# Altium schematic sheet Quectel_BG77_SCH_Part_AD_V1.1.SchDoc
size 840 x 594 mm
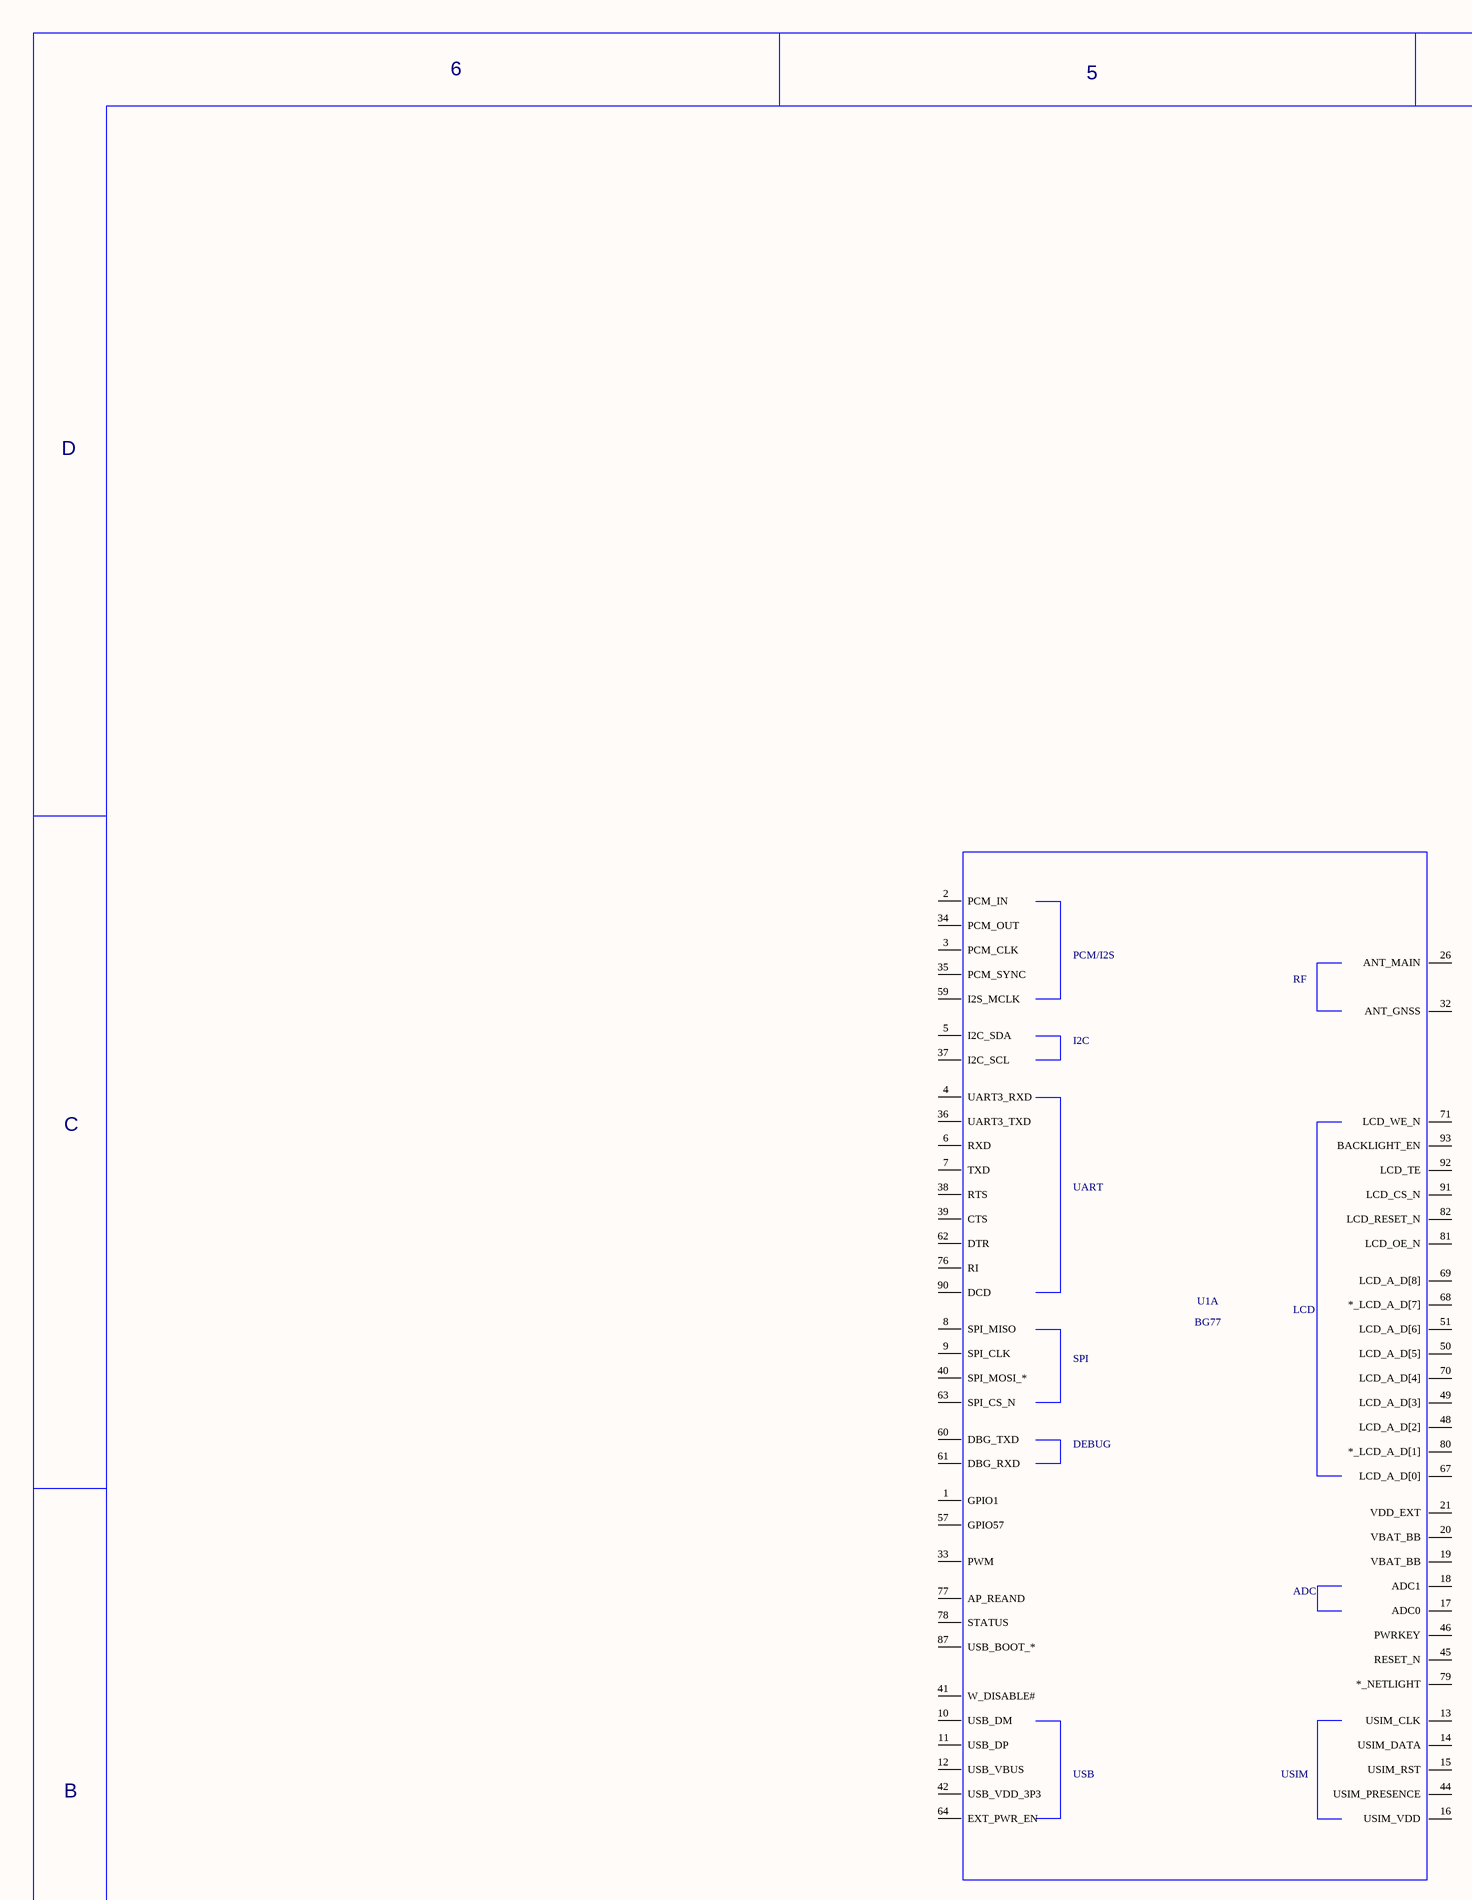
[diagram p0: Quectel_BG77_SCH_Part_AD_V1.1.SchDoc, top left]
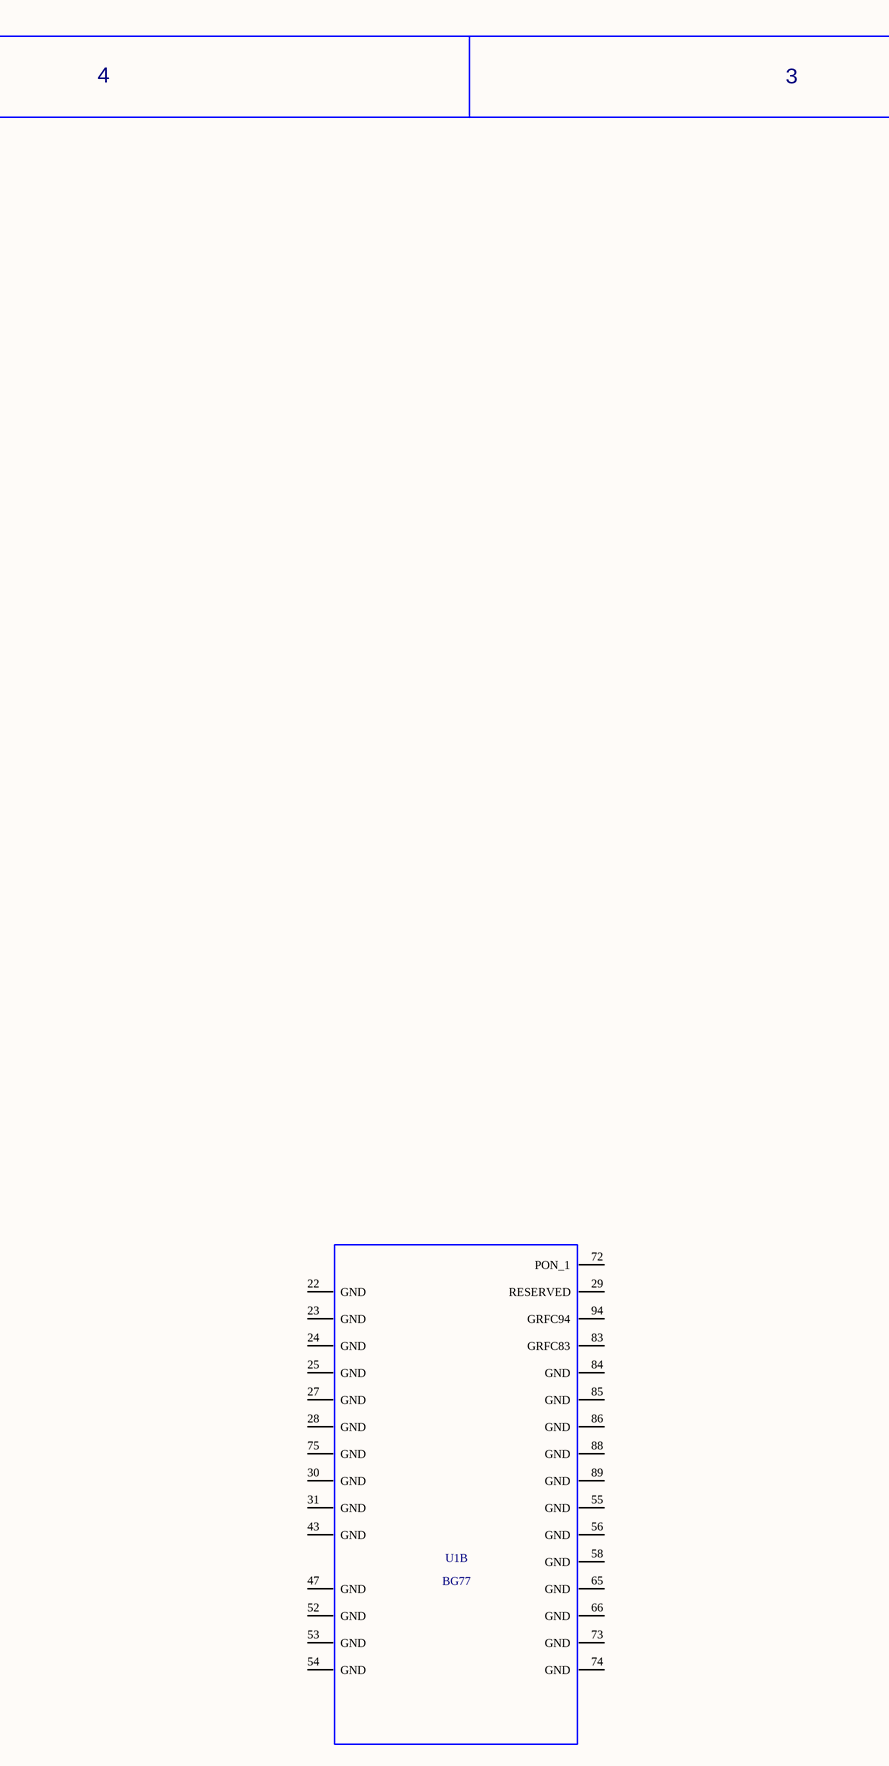
[diagram p1: Quectel_BG77_SCH_Part_AD_V1.1.SchDoc, top middle]
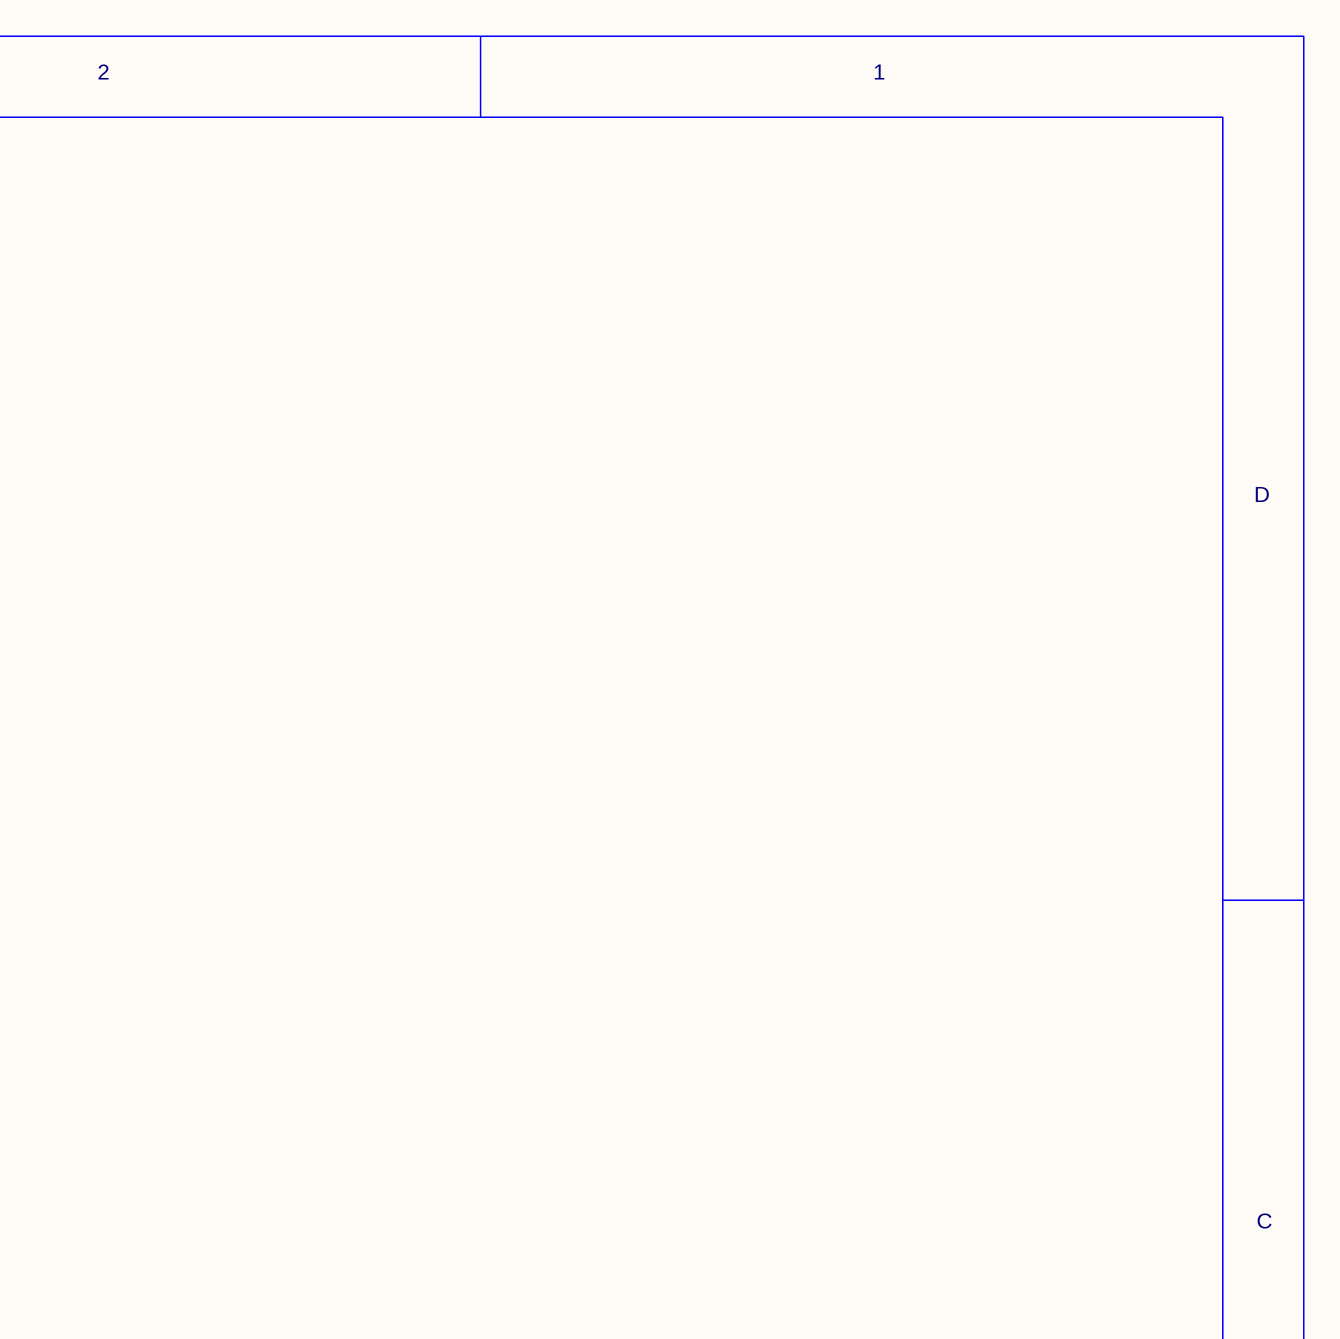
[diagram p2: Quectel_BG77_SCH_Part_AD_V1.1.SchDoc, top right]
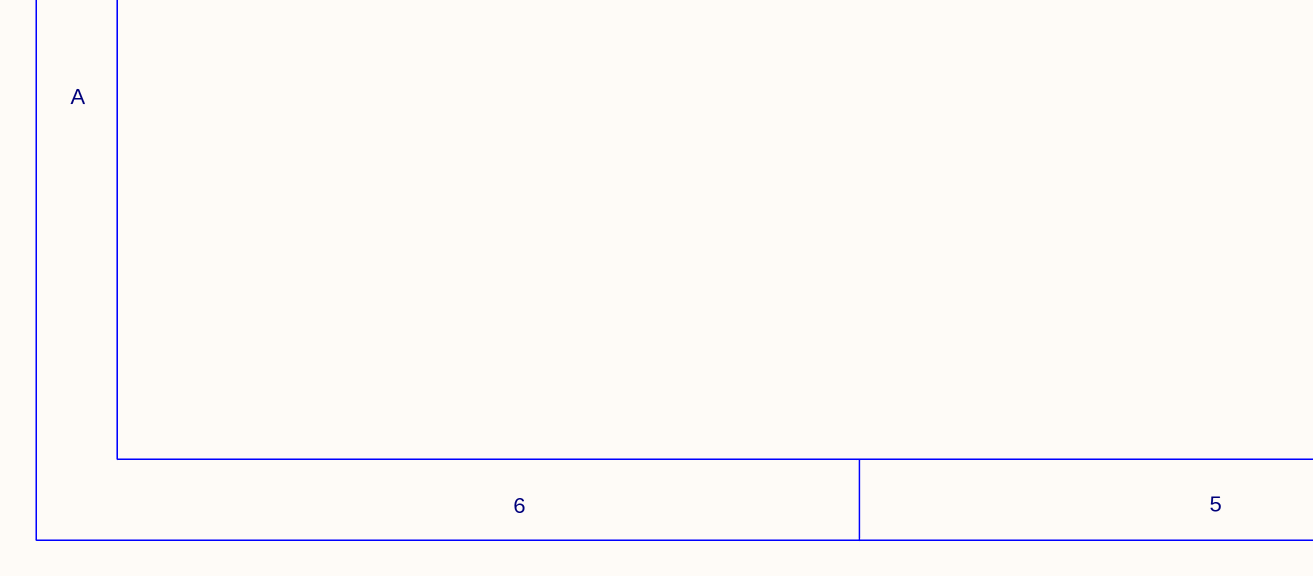
[diagram p3: Quectel_BG77_SCH_Part_AD_V1.1.SchDoc, bottom left]
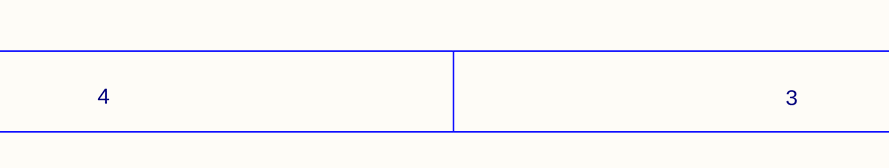
[diagram p4: Quectel_BG77_SCH_Part_AD_V1.1.SchDoc, bottom middle]
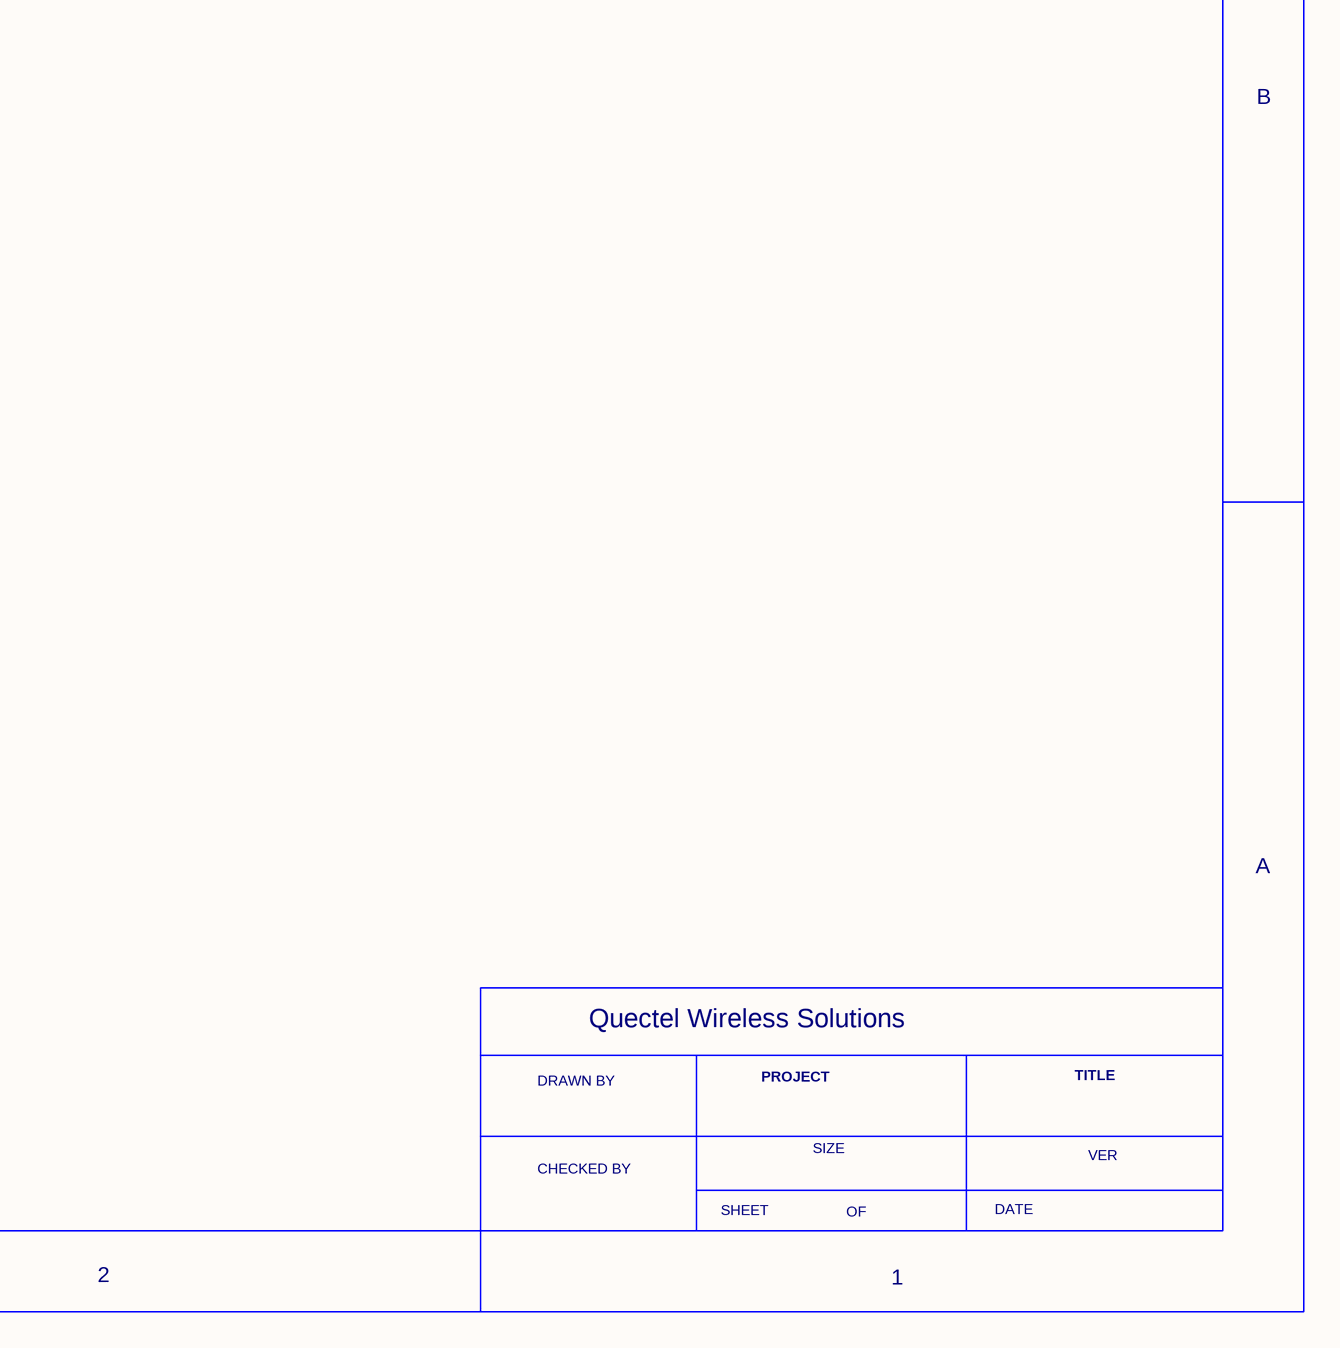
[diagram p5: Quectel_BG77_SCH_Part_AD_V1.1.SchDoc, bottom right]

## Parts
U1  BG77  (parts A,B of 2)

## Nets

Not connected (* = marked no-connect by the designer): U1 1(GPIO1) 2(PCM_IN) 3(PCM_CLK) 4(UART3_RXD) 5(I2C_SDA) 6(RXD) 7(TXD) 8(SPI_MISO) 9(SPI_CLK) 10(USB_DM) 11(USB_DP) 12(USB_VBUS) 13(USIM_CLK) 14(USIM_DATA) 15(USIM_RST) 16(USIM_VDD) 17(ADC0) 18(ADC1) 19(VBAT_BB) 20(VBAT_BB) 21(VDD_EXT) 22(GND) 23(GND) 24(GND) 25(GND) 26(ANT_MAIN) 27(GND) 28(GND) 29(RESERVED) 30(GND) 31(GND) 32(ANT_GNSS) 33(PWM) 34(PCM_OUT) 35(PCM_SYNC) 36(UART3_TXD) 37(I2C_SCL) 38(RTS) 39(CTS) 40(SPI_MOSI_*) 41(W_DISABLE#) 42(USB_VDD_3P3) 43(GND) 44(USIM_PRESENCE) 45(RESET_N) 46(PWRKEY) 47(GND) 48(LCD_A_D[2]) 49(LCD_A_D[3]) 50(LCD_A_D[5]) 51(LCD_A_D[6]) 52(GND) 53(GND) 54(GND) 55(GND) 56(GND) 57(GPIO57) 58(GND) 59(I2S_MCLK) 60(DBG_TXD) 61(DBG_RXD) 62(DTR) 63(SPI_CS_N) 64(EXT_PWR_EN) 65(GND) 66(GND) 67(LCD_A_D[0]) 68(*_LCD_A_D[7]) 69(LCD_A_D[8]) 70(LCD_A_D[4]) 71(LCD_WE_N) 72(PON_1) 73(GND) 74(GND) 75(GND) 76(RI) 77(AP_REAND) 78(STATUS) 79(*_NETLIGHT) 80(*_LCD_A_D[1]) 81(LCD_OE_N) 82(LCD_RESET_N) 83(GRFC83) 84(GND) 85(GND) 86(GND) 87(USB_BOOT_*) 88(GND) 89(GND) 90(DCD) 91(LCD_CS_N) 92(LCD_TE) 93(BACKLIGHT_EN) 94(GRFC94)

## Notes on the sheet
- 6
- 5
- 4
- 3
- 2
- 1
- D
- (near U1) PCM/I2S
- (near U1) RF
- (near U1) I2C
- C
- (near U1) UART
- (near U1) LCD
- (near U1) SPI
- (near U1) DEBUG
- (near U1) ADC
- B
- (near U1) USB
- (near U1) USIM
- A
- Quectel Wireless Solutions
- DRAWN BY
- PROJECT
- TITLE
- CHECKED BY
- SIZE
- VER
- SHEET
- OF
- DATE

## Library data of the parts
U1 = BG77: Manufacturer: QUECTEL; Part Description: IC MODULE BG77 LGA-94 14.9x12.9mm H1.7mm RO; Geometry.Height: 1.7mm; Value: BG77; PCB DECAL: BG77